# Altium schematic sheet sb-sonata-fpgaio2.SchDoc: IO Banks 15 + 16
size Letter; Organization: NewAE Technology Inc.; Address1: 1083 Queen St., Suite 196; Address2: Halifax; Address3: NS; Address4: Canada B3H 0B2; SheetNumber: 13; SheetTotal: 20; SheetApproved: YES
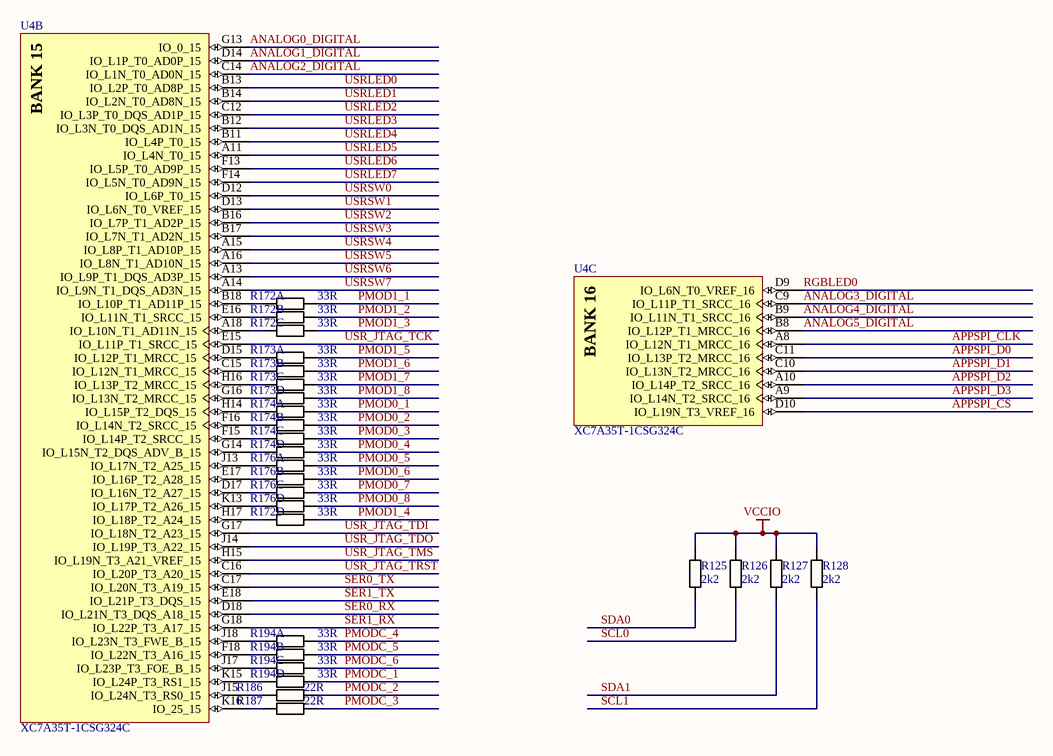
[diagram p0: sb-sonata-fpgaio2.SchDoc]

## Parts
R125  2k2  [RESC1608X55N]
R126  2k2  [RESC1608X55N]
R127  2k2  [RESC1608X55N]
R128  2k2  [RESC1608X55N]
R172  33R  [741C083]  (parts A,B,C,D of 4)
R173  33R  [741C083]  (parts A,B,C,D of 4)
R174  33R  [741C083]  (parts A,B,C,D of 4)
R176  33R  [741C083]  (parts A,B,C,D of 4)
R186  22R  [RESC1005X40N]
R187  22R  [RESC1005X40N]
R194  33R  [741C083]  (parts A,B,C,D of 4)
U4  XC7A35T-1CSG324C  [CSG324]  (parts B,C of 9)

## Nets
VCCIO: R125.1 R126.1 R127.1 R128.1
ANALOG0_DIGITAL: U4.G13(IO_0_15)
ANALOG1_DIGITAL: U4.D14(IO_L1P_T0_AD0P_15)
ANALOG2_DIGITAL: U4.C14(IO_L1N_T0_AD0N_15)
ANALOG3_DIGITAL: U4.C9(IO_L11P_T1_SRCC_16)
ANALOG4_DIGITAL: U4.B9(IO_L11N_T1_SRCC_16)
ANALOG5_DIGITAL: U4.B8(IO_L12P_T1_MRCC_16)
APPSPI_CLK: U4.A8(IO_L12N_T1_MRCC_16)
APPSPI_CS: U4.D10(IO_L19N_T3_VREF_16)
APPSPI_D0: U4.C11(IO_L13P_T2_MRCC_16)
APPSPI_D1: U4.C10(IO_L13N_T2_MRCC_16)
APPSPI_D2: U4.A10(IO_L14P_T2_SRCC_16)
APPSPI_D3: U4.A9(IO_L14N_T2_SRCC_16)
PMOD0_1: R174.1B
PMOD0_2: R174.2B
PMOD0_3: R174.3B
PMOD0_4: R174.4B
PMOD0_5: R176.1B
PMOD0_6: R176.2B
PMOD0_7: R176.3B
PMOD0_8: R176.4B
PMOD1_1: R172.1B
PMOD1_2: R172.2B
PMOD1_3: R172.3B
PMOD1_4: R172.4B
PMOD1_5: R173.1B
PMOD1_6: R173.2B
PMOD1_7: R173.3B
PMOD1_8: R173.4B
PMODC_1: R194.4B
PMODC_2: R186.2
PMODC_3: R187.2
PMODC_4: R194.1B
PMODC_5: R194.2B
PMODC_6: R194.3B
RGBLED0: U4.D9(IO_L6N_T0_VREF_16)
SCL0: R126.2
SCL1: R128.2
SDA0: R125.2
SDA1: R127.2
SER0_RX: U4.D18(IO_L21N_T3_DQS_A18_15)
SER0_TX: U4.C17(IO_L20N_T3_A19_15)
SER1_RX: U4.G18(IO_L22P_T3_A17_15)
SER1_TX: U4.E18(IO_L21P_T3_DQS_15)
USR_JTAG_TCK: U4.E15(IO_L11P_T1_SRCC_15)
USR_JTAG_TDI: U4.G17(IO_L18N_T2_A23_15)
USR_JTAG_TDO: U4.J14(IO_L19P_T3_A22_15)
USR_JTAG_TMS: U4.H15(IO_L19N_T3_A21_VREF_15)
USR_JTAG_TRST: U4.C16(IO_L20P_T3_A20_15)
USRLED0: U4.B13(IO_L2P_T0_AD8P_15)
USRLED1: U4.B14(IO_L2N_T0_AD8N_15)
USRLED2: U4.C12(IO_L3P_T0_DQS_AD1P_15)
USRLED3: U4.B12(IO_L3N_T0_DQS_AD1N_15)
USRLED4: U4.B11(IO_L4P_T0_15)
USRLED5: U4.A11(IO_L4N_T0_15)
USRLED6: U4.F13(IO_L5P_T0_AD9P_15)
USRLED7: U4.F14(IO_L5N_T0_AD9N_15)
USRSW0: U4.D12(IO_L6P_T0_15)
USRSW1: U4.D13(IO_L6N_T0_VREF_15)
USRSW2: U4.B16(IO_L7P_T1_AD2P_15)
USRSW3: U4.B17(IO_L7N_T1_AD2N_15)
USRSW4: U4.A15(IO_L8P_T1_AD10P_15)
USRSW5: U4.A16(IO_L8N_T1_AD10N_15)
USRSW6: U4.A13(IO_L9P_T1_DQS_AD3P_15)
USRSW7: U4.A14(IO_L9N_T1_DQS_AD3N_15)
NetR172_1A: R172.1A U4.B18(IO_L10P_T1_AD11P_15)
NetR172_2A: R172.2A U4.E16(IO_L11N_T1_SRCC_15)
NetR172_3A: R172.3A U4.A18(IO_L10N_T1_AD11N_15)
NetR172_4A: R172.4A U4.H17(IO_L18P_T2_A24_15)
NetR173_1A: R173.1A U4.D15(IO_L12P_T1_MRCC_15)
NetR173_2A: R173.2A U4.C15(IO_L12N_T1_MRCC_15)
NetR173_3A: R173.3A U4.H16(IO_L13P_T2_MRCC_15)
NetR173_4A: R173.4A U4.G16(IO_L13N_T2_MRCC_15)
NetR174_1A: R174.1A U4.H14(IO_L15P_T2_DQS_15)
NetR174_2A: R174.2A U4.F16(IO_L14N_T2_SRCC_15)
NetR174_3A: R174.3A U4.F15(IO_L14P_T2_SRCC_15)
NetR174_4A: R174.4A U4.G14(IO_L15N_T2_DQS_ADV_B_15)
NetR176_1A: R176.1A U4.J13(IO_L17N_T2_A25_15)
NetR176_2A: R176.2A U4.E17(IO_L16P_T2_A28_15)
NetR176_3A: R176.3A U4.D17(IO_L16N_T2_A27_15)
NetR176_4A: R176.4A U4.K13(IO_L17P_T2_A26_15)
NetR186_1: R186.1 U4.J15(IO_L24N_T3_RS0_15)
NetR187_1: R187.1 U4.K16(IO_25_15)
NetR194_1A: R194.1A U4.J18(IO_L23N_T3_FWE_B_15)
NetR194_2A: R194.2A U4.F18(IO_L22N_T3_A16_15)
NetR194_3A: R194.3A U4.J17(IO_L23P_T3_FOE_B_15)
NetR194_4A: R194.4A U4.K15(IO_L24P_T3_RS1_15)

## Notes on the sheet
- Title:
- Date:
- Rev:
- Time:
- Project:
- Sheet
- of
- License:
- Copyright © NewAE Technology Inc.
- Approved:
- NewAE.com
- File:
- (in symbol CMP-0383-00012-1, part B) BANK 15
- (in symbol CMP-0383-00012-1, part C) BANK 16

## Library data of the parts
R125-R128 = RCHIP-2K2-0603: 2k2 res, 0603, 1%, 1/10W; Manufacture 1: Yageo; Manufacture Part Number 1: RC0603FR-072K2L; Component Group: Resistor; Case-EIA: 0603; Case-Metric: 1608; Rated Power: 0.1W; Rated Voltage: 75VDC; Part Number: RCHIP-2K2-0603; Footprint: 0603; Pin Count: 2; Supplier 1: Digi-Key; Supplier Part Number 1: 311-2.20KHRCT-ND; Value: 2k2; Tolerance: 1%; Mounting Technology: SMT; Temperature Range: -55C to 155C; Component Kind: Standard; Component Type: Standard
R172-R174 R176 R194 = 741C083330JP: 33-ohm, 0.5mm res array; Manufacture 1: CTS; Component Group: Resistor; PP Material Stack: 0; Part Number: 741C083330JP; Manufacture Part Number 1: 741C083330JP; Pin Count: 8; Supplier 1: Digi-Key; Supplier Part Number 1: 741C083330JPCT-ND; Mounting Technology: SMT; Component Kind: Standard; Component Type: Standard; PP Rotation: 0; PP Rotation1: 0
R186 R187 = RCHIP-22R-0402: 22R res, 0402, 1%, 1/16W; Manufacture 1: Yageo; Manufacture Part Number 1: RC0402FR-0722RL; Component Group: Resistor; Case-EIA: 0402; Case-Metric: 1005; Rated Power: 0.063W; Rated Voltage: 75VDC; Part Number: RCHIP-22R-0402; Footprint: 0402; Pin Count: 2; Supplier 1: Digi-Key; Supplier Part Number 1: 311-22.0LRCT-ND; Value: 22R; Tolerance: 1%; Mounting Technology: SMT; Temperature Range: -55C to 155C; Component Kind: Standard; Component Type: Standard
U4 = CMP-0383-00012-1: Artix-7 FPGA, 210 User I/Os, 0 GTP, 324-Ball BGA, Speed Grade 1, Commercial Grade, Pb-Free; Manufacturer: Xilinx; GTP: 0; Available User I/O: 210; Speed Grades: 1; Logic Cells: 33280; Total Block RAM: 1800 Kb; CMTs: 5; Maximum Distributed RAM: 400 Kb; ComponentLink2URL: http://www.xilinx.com/support/documentation/data_sheets/ds180_7Series_Overview.pdf; ComponentLink2Description: Datasheet; DatasheetVersion: Rev. 1.15; PackageDescription: 324-Ball Wire-Bond Chip-Scale BGA, Body 15 x 15 mm, Pitch 0.8 mm; ComponentLink4URL: http://www.xilinx.com/support/documentation/user_guides/ug475_7Series_Pkg_Pinout.pdf; PackageReference: CSG-324; Mounting Technology: Surface Mount; PackageVersion: Rev. 1.11; ComponentLink1Description: Manufacturer URL; ComponentLink3Description: Pinout; ComponentLink1URL: http://www.xilinx.com/; ComponentLink3URL: http://www.xilinx.com/support/documentation/user_guides/ug475_7Series_Pkg_Pinout.pdf; PartNumber: XC7A35T-1CSG324C; ComponentLink4Description: Package Specification; Operating Temperature Range: Commercial